# EAGLE design MCU board_in_foot_v1 (EAGLE 8.3.0)
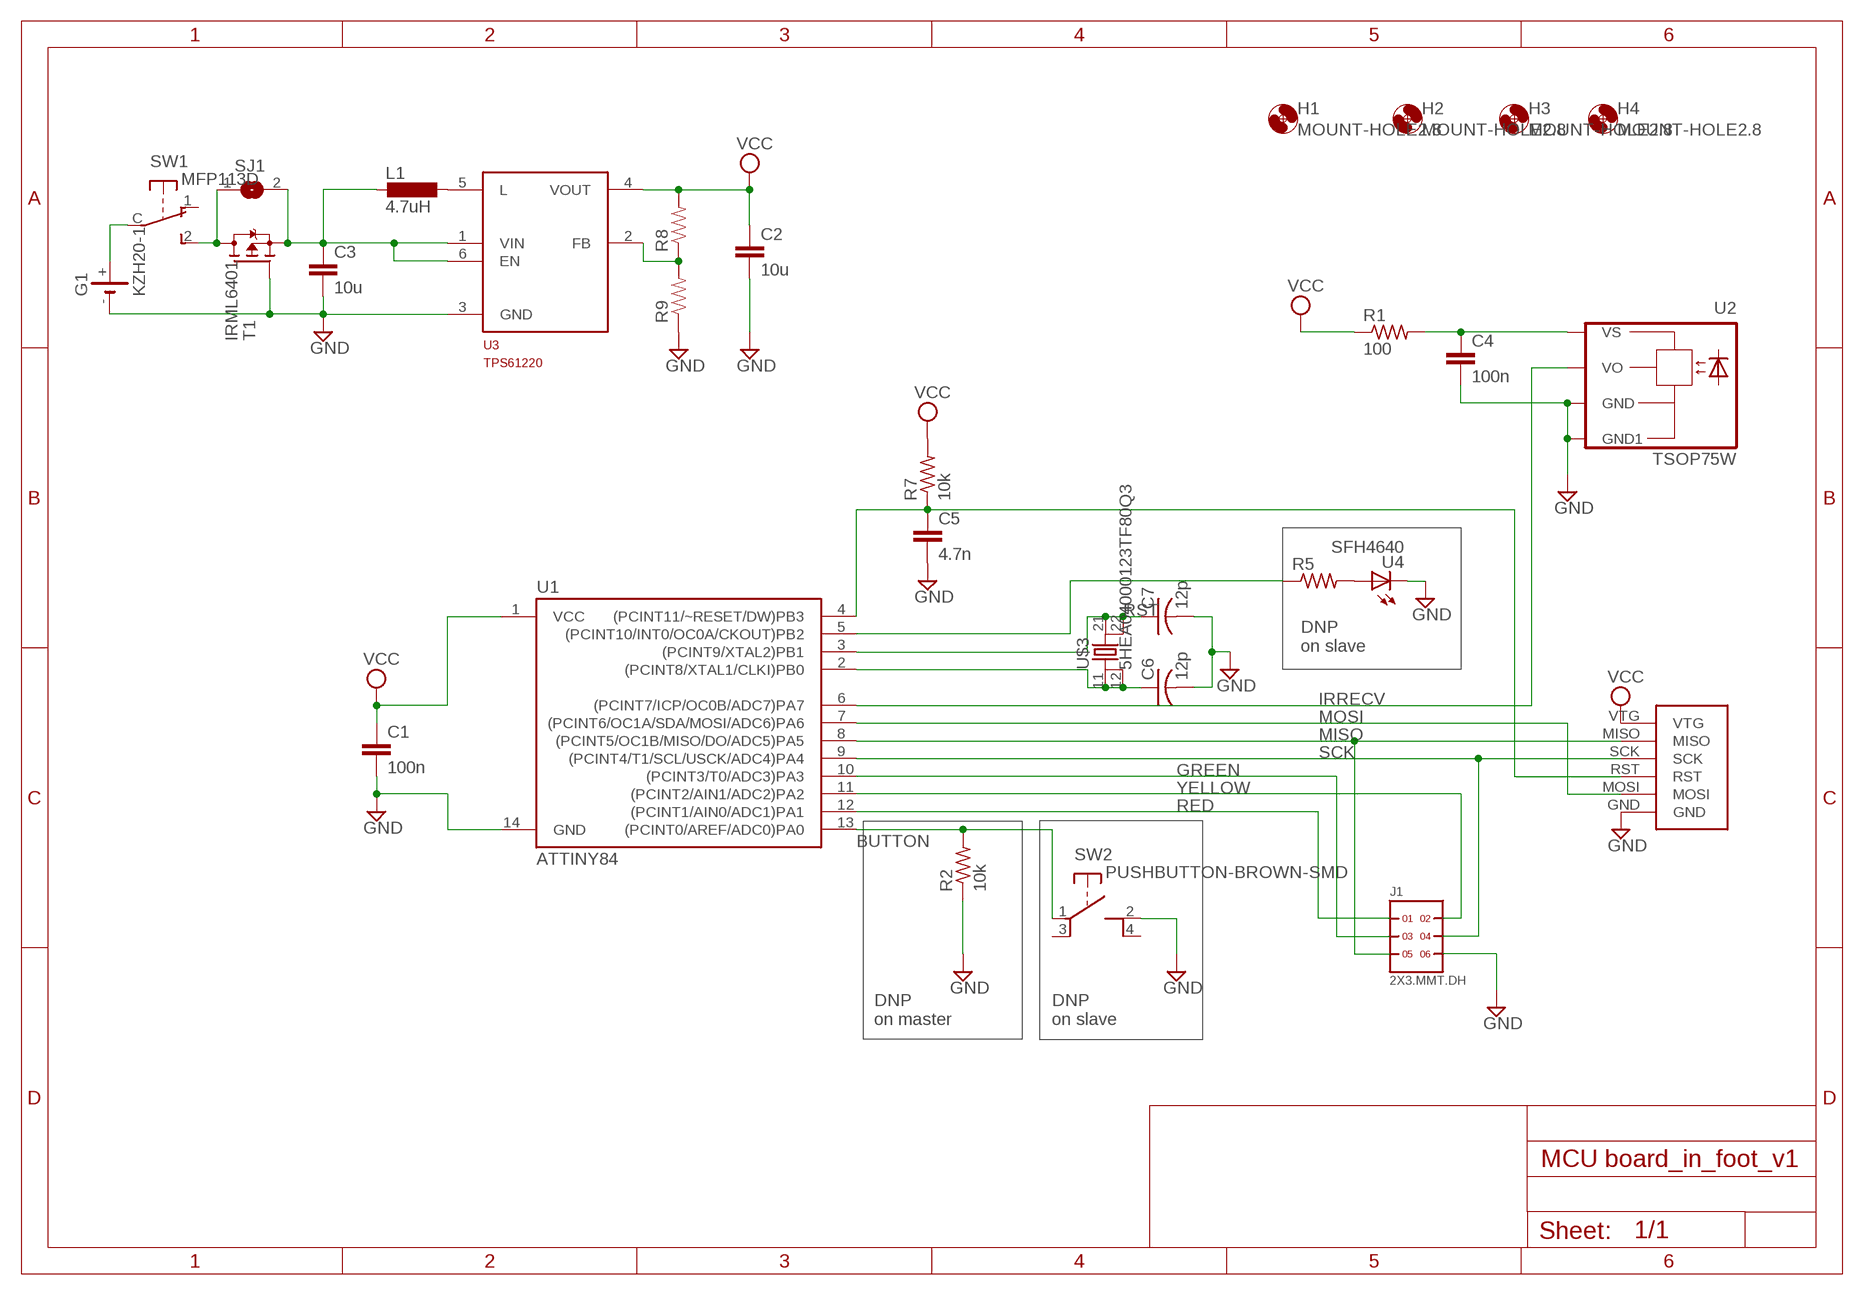
[diagram p0: schematic, sheet 1]

## Parts
C1  100n  CAP0603-CAP  [0603-CAP]
C2  10u  CAP0603-CAP  [0603-CAP]
C3  10u  CAP0603-CAP  [0603-CAP]
C4  100n  CAP0603-CAP  [0603-CAP]
C5  4.7n  CAP0603-CAP  [0603-CAP]
C6  12p  C-USC0805  [C0805]
C7  12p  C-USC0805  [C0805]
G1  KZH20-1  [KZH20-1]
H1  MOUNT-HOLE2.8  [2,8]
H2  MOUNT-HOLE2.8  [2,8]
H3  MOUNT-HOLE2.8  [2,8]
H4  MOUNT-HOLE2.8  [2,8]
ISP  ISP_POGOSURFACE  [ISP_SURFACE]
J1  2X3.MMT.DH  [2X3_MMT.103.01.X.DH]
L1  4.7uH  EPL2010  [EPL2010]
R1  100  R-US_R0402  [R0402]
R2  10k  R-US_R0402  [R0402]
R5  R-US_R0402  [R0402]
R7  10k  R-US_R0402  [R0402]
R8  RESISTOR0603-RES  [0603-RES]
R9  RESISTOR0603-RES  [0603-RES]
SJ1  SJ  [SJ]
SW1  MFP113D  [MFP-SLIDER]
SW2  PUSHBUTTON-BROWN-SMD  [SMD-SW]
T1  IRML6401  [SOT23]
U1  ATTINY84  [SO14]
U2  TSOP75W  [TSOP75W-SIDELOOK]
U3  TPS61220  [DCK-R_PDSO_G6]
U4  SFH4640  [MIDLED]
U$3  5HEA04000123TF80Q3  [10X4.5MM]

## Nets
BUTTON: R2.2 SW2.1 U1.13((PCINT0/AREF/ADC0)PA0)
GND: C1.2 C2.2 C3.2 C4.2 C5.2 C6.2 C7.2 G1.- ISP.GND J1.6 R2.1 R9.1 SW2.2(S2) T1.1(G) U1.14(GND) U2.1(GND) U2.4(GND1) U3.3(GND) U4.K(C)
GREEN: J1.3 U1.10((PCINT3/T0/ADC3)PA3)
IRRECV: U1.6((PCINT7/ICP/OC0B/ADC7)PA7) U2.3(VO)
IRSEND: R5.1 U1.5((PCINT10/INT0/OC0A/CKOUT)PB2)
MISO: ISP.MISO J1.5 U1.8((PCINT5/OC1B/MISO/DO/ADC5)PA5)
MOSI: ISP.MOSI U1.7((PCINT6/OC1A/SDA/MOSI/ADC6)PA6)
N$1: L1.P$2 U3.5(L)
N$3: SJ1.1 SW1.2(S) T1.3(D)
N$4: C7.1 U1.3((PCINT9/XTAL2)PB1) U$3.21 U$3.22
N$5: R8.1 R9.2 U3.2(FB)
N$6: C6.1 U1.2((PCINT8/XTAL1/CLKI)PB0) U$3.11 U$3.12
N$7: C4.1 R1.2 U2.2(VS)
N$8: G1.+ SW1.C(P)
N$11: R5.2 U4.A
RED: J1.1 U1.12((PCINT1/AIN0/ADC1)PA1)
RST: C5.1 ISP.RST R7.1 U1.4((PCINT11/~RESET/DW)PB3)
SCK: ISP.SCK J1.4 U1.9((PCINT4/T1/SCL/USCK/ADC4)PA4)
VBAT: C3.1 L1.P$1 SJ1.2 T1.2(S) U3.1(VIN) U3.6(EN)
VCC: C1.1 C2.1 ISP.VTG R1.1 R7.2 R8.2 U1.1(VCC) U3.4(VOUT)
YELLOW: J1.2 U1.11((PCINT2/AIN1/ADC2)PA2)
Unconnected: SW1.1(O) SW2.3 SW2.4(S4)

## Notes on the sheet
- DNP
  on slave
- DNP
  on master
- DNP
  on slave

## Library data of the parts
C1-C5 = MCU board_in_foot:CAP: Capacitor Standard 0603 ceramic capacitor, and 0.1" leaded capacitor.
C6 C7 = MCU board_in_foot:C-US: CAPACITOR, American symbol
G1 = MCU board_in_foot:KZH20-1: CR2302 battery holder
H1-H4 = MCU board_in_foot:MOUNT-HOLE: MOUNTING HOLE with drill center marker
ISP = MCU board_in_foot:ISP_POGO
J1 = MCU board_in_foot:2X3
L1 = MCU board_in_foot:EPL2010: Very small inductor
R1 R2 R5 R7 = MCU board_in_foot:R-US_: RESISTOR, American symbol
R8 R9 = MCU board_in_foot:RESISTOR: Resistor Basic schematic elements and footprints for 0603, 1206, and PTH resistors.
SJ1 = MCU board_in_foot:SJ: SMD solder JUMPER
SW1 = MCU board_in_foot:MFP113D
SW2 = MCU board_in_foot:PUSHBUTTON-BROWN-SMD
T1 = MCU board_in_foot:IRML6401
U1 = MCU board_in_foot:ATTINY84: Atmel 14-pin 2/4/8kB flash uC; PROD_ID: IC-11285
U2 = MCU board_in_foot:TSOP75*W
U3 = MCU board_in_foot:TPS61220
U4 = MCU board_in_foot:SFH4640: OSRAM SFH4640 Narrom beam LED in a MIDLED package (940nm) Toplooker or sidelooker.
U$3 = MCU board_in_foot:5HEA04000123TF80Q3

## Board
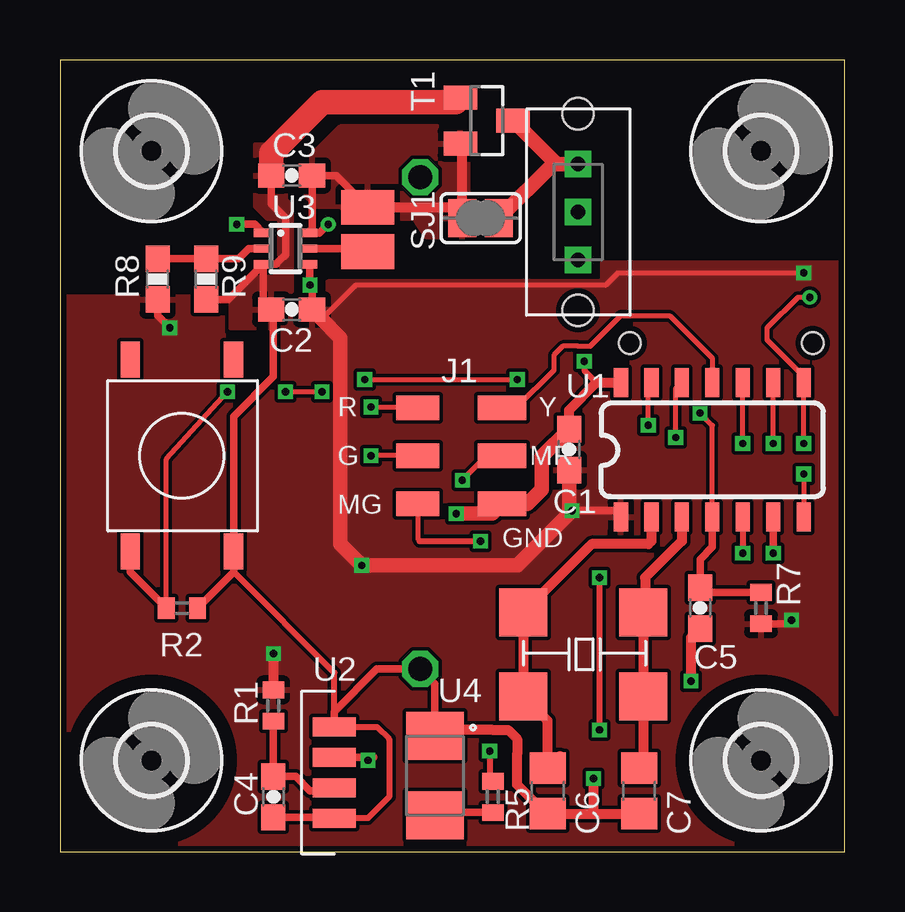
[diagram p1: board, top side]
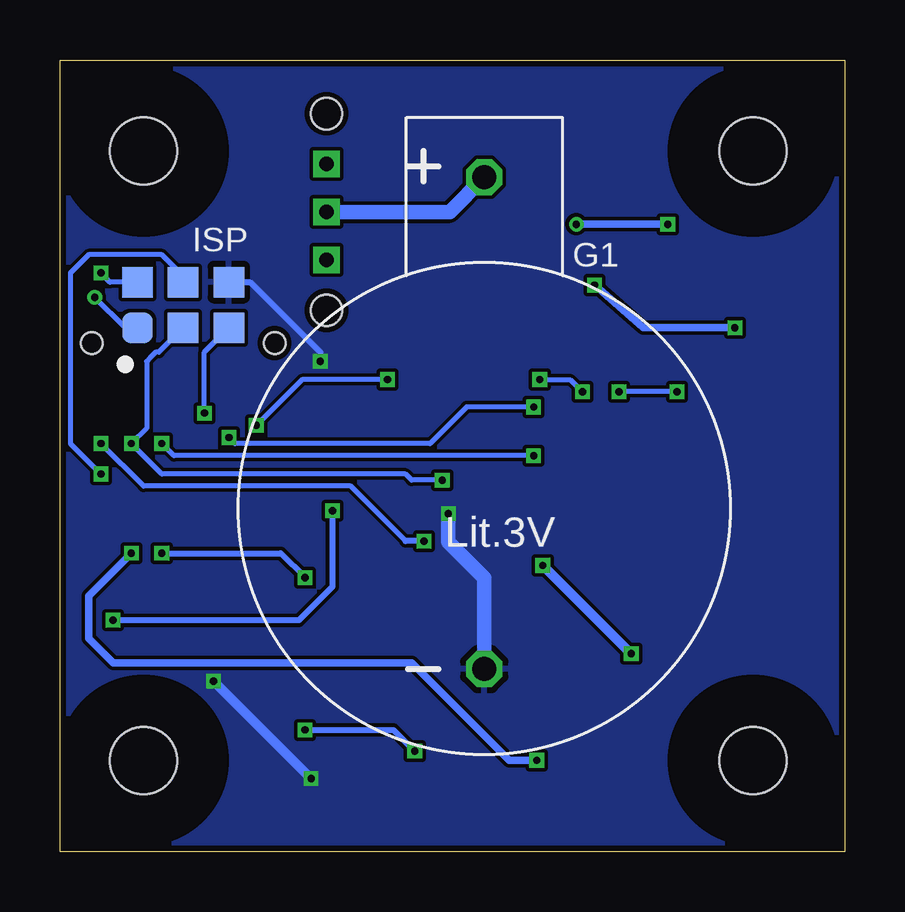
[diagram p2: board, bottom side, seen from below]

Size 32.69 x 33.01 mm. Coordinates in mm from the lower left corner, seen from the top.
Outline: 0,0 32.69,0 32.69,33.01 0,33.01 0,0
Copper layers (1*16): Top 0.035mm / dielectric 1.5mm / Bottom 0.035mm
Design rules "SeeedStudio_2layer_DRU_no_angle_20140221": minimum track width 6mil, minimum drill 12mil, track to track 6mil, track to pad 6mil, pad to pad 6mil, via to via 6mil, smd to smd 0mil, copper to edge 10mil, drill to drill 10mil, minimum pad ring 10mil, minimum via ring 6mil, stop-mask expansion 2mil, vias tented up to drill 100mil, thermal gap 10mil

### Footprints (pad centres in the part's own frame; a part is rotated, then mirrored left to right if it is on the bottom)
0603-CAP = smd 1.1 x 1: 1 -0.85,0; 2 0.85,0
C0805 = smd 1.3 x 1.5: 1 -0.95,0; 2 0.95,0
KZH20-1 = drill 1 octagon: + 0,20.5; - 0,0
2,8 = hole 2.8: 0,0
ISP_SURFACE = smd 1.27 x 1.27: GND 0,-1.905; MISO 3.81,0; MOSI 1.905,-1.905; RST 0,0; SCK 1.905,0; VTG 3.81,-1.905 | hole 0.9: -1.905,0.635; 5.715,0.635
2X3_MMT.103.01.X.DH = smd 1.016 x 1.778: 1 -2,-1.6; 3 0,-1.6; 5 2,-1.6 | smd 1.016 x 2.032: 2 -2,1.905; 4 0,1.905; 6 2,1.905
EPL2010 = smd 1.44 x 2.2: P$1 -0.2,0; P$2 1.65,0
R0402 = smd 0.7 x 0.9: 1 -0.65,0; 2 0.65,0
0603-RES = smd 1.1 x 1: 1 -0.85,0; 2 0.85,0
SJ = smd 1.168 x 1.6: 1 -0.762,0; 2 0.762,0
MFP-SLIDER = drill 0.6 square: 1 -2,0; 2 2,0; C 0,0 | hole 1.3: -4.1,0; 4.1,0
SMD-SW = smd 0.8 x 1.5: 1 -2.15,-4; 2 2.15,-4; 3 2.15,4; 4 -2.15,4
SOT23 = smd 1 x 1.4: 1 -0.95,-1.1; 2 0.95,-1.1; 3 0,1.1
SO14 = smd 0.6 x 1.2: 1 -3.81,-2.8; 2 -2.54,-2.8; 3 -1.27,-2.8; 4 0,-2.8; 5 1.27,-2.8; 6 2.54,-2.8; 7 3.81,-2.8; 8 3.81,2.8; 9 2.54,2.8; 10 1.27,2.8; 11 0,2.8; 12 -1.27,2.8; 13 -2.54,2.8; 14 -3.81,2.8
TSOP75W-SIDELOOK = smd 0.8 x 1.8: 1 -1.905,0; 2 -0.635,0; 3 0.635,0; 4 1.905,0
DCK-R_PDSO_G6 = smd 0.35 x 0.8: 1 -0.65,-0.925; 2 0,-0.925; 3 0.65,-0.925; 4 0.65,0.925; 5 0,0.925; 6 -0.65,0.925
MIDLED = smd 2.4 x 2: A 0,1.65; K 0,-1.65
10X4.5MM = smd 2 x 2: 11 0,3.5; 12 0,0; 21 5,3.5; 22 5,0

### Placement (x,y rotation side)
C1  21.21,16.76 90 top
C2  9.65,22.61 180 top
C3  9.65,28.19 180 top
C4  8.89,2.29 270 top
C5  26.67,10.16 270 top
C6  20.32,2.54 270 top
C7  24.13,2.54 270 top
G1  15.01,7.62 0 bottom
H1  29.21,3.81 0 top
H2  3.81,3.81 0 top
H3  3.81,29.21 0 top
H4  29.21,29.21 0 top
ISP  25.65,21.84 180 bottom
J1  16.51,16.51 270 top
L1  12.83,26.67 270 top
R1  8.89,6.1 270 top
R2  5.08,10.16 180 top
R5  18.03,2.29 270 top
R7  29.21,10.16 270 top
R8  4.06,23.88 270 top
R9  6.1,23.88 90 top
SJ1  17.53,26.42 180 top
SW1  21.59,26.67 90 top
SW2  5.08,16.51 0 top
T1  17.78,30.48 270 top
U1  27.18,16.76 0 top
U2  11.43,3.3 90 top
U3  9.4,25.15 270 top
U4  15.62,3.17 180 top
U$3  19.3,6.48 0 top

### Tracks (layer width: path | path; a pad name or v marks a point on that pad's centre or on a via)
BUTTON  (via drill 0.3)
  Top 0.203: R2.2 4.43,16.37 v6.99,19.18 | v9.4,19.18 v10.92,19.18 | v12.7,19.68 13.34,19.68 13.97,19.68 v19.05,19.68 | v24.51,17.78 24.51,19.44 U1.13
  Top 0.305: SW2.1 2.93,11.66 R2.2
  Bottom 0.203: v6.99,19.18 v9.4,19.18 | v19.05,19.68 22.61,19.68 v24.51,17.78 | v12.7,19.68 11.43,19.68 v10.92,19.18
GND  (via drill 0.3)
  Top 0.254: C6.2 20.25,1.59 | 15.88,5.08 U4.K | U2.4 13.21,5.21 13.72,4.7 13.72,2.29 12.83,1.4 U2.1 | 11.43,5.84 11.43,7.46 7.23,11.66 | v21.84,20.45 21.84,20.07 22.35,19.56
  Top 0.305: C3.2 8.8,27.01 9.4,26.42 9.4,24.89 9.14,24.64 9,24.5 U3.3 | U3.3 8.47,22.93 C2.2 8.89,22.52 8.89,19.81 7.23,18.15 SW2.2 7.23,11.66 R2.1 | R9.1 7,23.03 U3.3 | C4.2 11.39,1.44 U2.1 | U2.4 11.43,5.84 13.21,7.62 G1.- 15.62,7.01 U4.K
  Top 0.406: C1.2 21.21,18.41 22.35,19.56 U1.14 | C6.2 22.23,1.59 | 22.23,1.59 C7.2 | 20.25,1.59 19.05,2.79 19.05,4.06 19.05,4.7 18.67,5.08 18.03,5.08 15.88,5.08 | C5.2 26.29,8.93 v26.29,7.11 | v22.23,3.05 22.23,1.59
  Top 0.61: v16.51,14.1 18,14.1 J1.6 19.46,14.51 20.07,15.11 20.07,16.47 C1.2
  Top 1.016: C3.2 8.8,29.12 10.92,31.24 16.49,31.24 T1.1
  Bottom 0.254: ISP.GND 24.77,23.75 21.84,20.83 v21.84,20.45
  Bottom 0.406: v26.29,7.11 v22.23,3.05
  Bottom 0.61: G1.- 15.01,11.41 16.51,12.91 v16.51,14.1
  pour Top: 7.11,21.84 9.4,21.84 9.4,22.35 9.4,23.11 9.65,23.37 9.65,26.92 9.4,27.18 9.4,29.46 8.13,29.46 8.13,26.92 8.64,26.42 9.14,26.42 9.14,24.64 8.89,24.64 8.38,24.13 7.11,22.86
  pour Bottom: 0,33.02 32.64,33.02 32.64,-0.25 0,-0.25
GREEN  (via drill 0.3)
  Top 0.203: J1.3 v12.95,16.51 | v28.45,17.02 U1.10
  Bottom 0.203: v12.95,16.51 27.94,16.51 v28.45,17.02
IRRECV  (via drill 0.3)
  Top 0.305: U2.3 13.08,3.94 v12.83,3.81 | v29.72,12.45 U1.6
  Bottom 0.305: v12.83,3.81 13.97,3.81 18.03,7.87 30.48,7.87 31.5,8.89 31.5,10.67 v29.72,12.45
IRSEND  (via drill 0.3)
  Top 0.254: U1.5 v28.45,12.45 | v22.48,11.43 v22.48,5.08 | v17.91,4.19 17.91,3.06 R5.1
  Bottom 0.254: v28.45,12.45 23.5,12.45 v22.48,11.43 | v22.48,5.08 18.8,5.08 v17.91,4.19
MISO  (via drill 0.3)
  Top 0.203: J1.5 14.91,13.03 14.99,12.95 | v30.99,17.02 U1.8 30.99,19.81 29.46,21.34 ISP.MISO 30.73,23.11 v31.24,23.11
  Top 0.254: 14.99,12.95 v17.53,12.95
  Bottom 0.203: 18.29,12.95 20.57,15.24 29.21,15.24 v30.99,17.02 | ISP.MISO 29.97,21.84 v31.24,23.11
  Bottom 0.254: v17.53,12.95 18.29,12.95
MOSI  (via drill 0.3)
  Top 0.203: v30.99,15.75 U1.7
  Bottom 0.203: ISP.MOSI 27.56,24 28.45,24.89 31.5,24.89 32.26,24.13 32.26,17.02 v30.99,15.75
N$1
  Top 0.305: U3.5 12.7,25.15 L1.P$2
N$3
  Top 0.61: T1.3 20.69,28.67 SW1.2 20.54,28.67 SJ1.1
N$4
  Top 0.406: 24.33,3.69 C7.1 24.3,3.66 U$3.22 U$3.21 24.38,10.06 24.38,11.43 25.91,12.95 U1.3
N$5
  Top 0.305: R8.1 R9.2 7.45,24.73 7.87,25.15 U3.2
N$6
  Top 0.406: U1.2 24.64,13.72 24.64,12.95 24.51,12.83 22.15,12.83 U$3.11 U$3.12 20.32,5.46 C6.1 20.83,4
N$7
  Top 0.305: R1.2 C4.1 9.82,3.14 10.41,2.54 11.3,2.54 U2.2
N$8
  Bottom 0.61: SW1.C 16.46,26.67 G1.+
N$11
  Top 0.305: R5.2 15.73,1.64 U4.A
RED  (via drill 0.3)
  Top 0.203: J1.1 12.99,18.51 v12.95,18.54 | v25.65,17.27 25.65,19.31 U1.12
  Bottom 0.203: v12.95,18.54 15.75,18.54 17.27,17.02 25.4,17.02 v25.65,17.27
RST  (via drill 0.3)
  Top 0.203: U1.4 27.18,17.78 v26.67,18.29
  Top 0.305: U1.4 27.18,12.7 26.67,12.19 C5.1 26.87,10.81 R7.1
  Bottom 0.203: v26.67,18.29 26.67,20.83 ISP.RST
SCK  (via drill 0.3)
  Top 0.203: 29.72,20.07 U1.9 v29.72,17.02 | J1.4 17.78,16.51 v16.76,15.49
  Bottom 0.203: ISP.SCK 28.57,20.83 28.7,20.83 28.96,20.57 29.08,20.45 29.08,17.65 v29.72,17.02 28.45,15.75 18.29,15.75 18.03,15.49 v16.76,15.49
VBAT  (via drill 0.3)
  Top 0.305: L1.P$1 11.5,28.19 C3.1 10.5,25.98 U3.6 10.81,25.8 v11.18,26.16 | v7.37,26.16 8.11,26.16 U3.1
  Top 0.406: L1.P$1 16.31,26.87 SJ1.2 16.76,29.45 T1.2
  Bottom 0.305: v11.18,26.16 v7.37,26.16
  pour Top: 11.94,26.42 14.73,26.42 15.24,25.65 17.02,25.65 17.02,28.7 17.27,28.96 17.27,29.97 16,29.97 15.75,30.23 11.68,30.23 10.16,28.7 10.16,27.43 10.67,26.92 11.68,26.92 11.94,26.67
VCC  (via drill 0.3)
  Top 0.203: v30.99,24.13 23.24,24.13 22.73,23.62 12.32,23.62 10.9,22.21
  Top 0.305: R7.2 30.34,9.51 v30.48,9.65 | U1.1 23.11,14.22 v21.34,14.22 21.34,15.79 C1.1 | R8.2 4.06,22.35 v4.57,21.84 | U3.4 10.41,24.41 v10.41,23.62 10.5,23.79 C2.1
  Top 0.406: v8.89,8.26 R1.1
  Top 0.61: C1.1 21.21,14.1 19.05,11.94 v12.57,11.94 11.68,12.83 11.68,14.73 11.68,21.42 10.9,22.21 C2.1
  Bottom 0.203: ISP.VTG 30.61,23.75 v30.99,24.13
  Bottom 0.254: v21.34,14.22 21.34,11.05 22.73,9.65 v30.48,9.65
  Bottom 0.305: v4.57,21.84 8.38,21.84 v10.41,23.62
  Bottom 0.406: v12.57,11.94 v8.89,8.26
  pour Top (rank 2): 32.77,24.51 22.61,24.51 22.61,23.75 11.18,23.75 11.18,23.11 0,23.11 0,-0.25 32.77,-0.25
YELLOW
  Top 0.203: J1.2 19.02,18.51 20.57,20.07 20.57,20.7 20.95,21.08 21.59,21.08 22.1,21.08 23.37,22.35 25.4,22.35 27.18,20.57 U1.11

### Text on the board
tNames: R | Y | G | MR | MG | GND | U2 | U4
bNames: ISP
bDocu: (c)2015 Martin Hans / Toy traffic light Rev 1